# Altium project MaUWB.PrjPcb
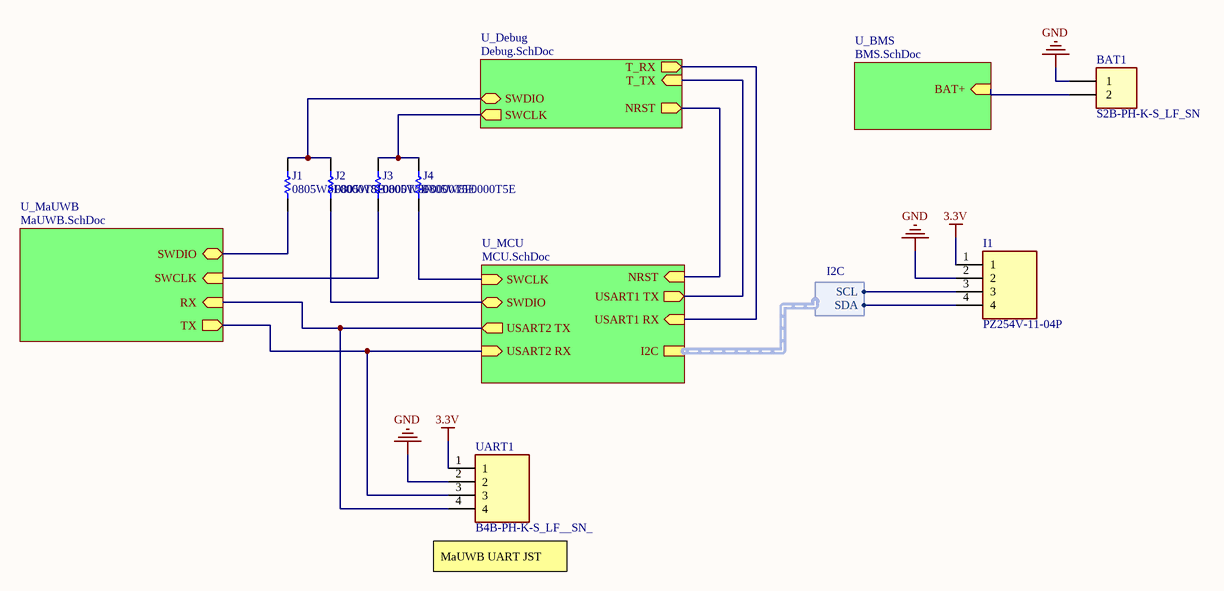
[diagram p0: Root.SchDoc]
5 sheets, 54 parts. Net scope: hierarchical (ports join the sheet entries above them; power ports are global).
Board file: PCB.PcbDoc
Sheets:
  Root.SchDoc
    U_BMS = BMS.SchDoc
    U_MaUWB = MaUWB.SchDoc
    U_MCU = MCU.SchDoc
    U_Debug = Debug.SchDoc

## Sheet Root.SchDoc
size A4; SheetNumber: 1; SheetTotal: 5

### Parts
BAT1  S2B-PH-K-S_LF_SN  [S2B-PH-K-S_LF_SN]
I1  PZ254V-11-04P  [HDRV4W64P0X254_1X4_1016X250X890P]
J1  0805W8F0000T5E  [RESC2013X65N - Duplicate1]
J2  0805W8F0000T5E  [RESC2013X65N - Duplicate1]
J3  0805W8F0000T5E  [RESC2013X65N - Duplicate1]
J4  0805W8F0000T5E  [RESC2013X65N - Duplicate1]
UART1  B4B-PH-K-S_LF__SN_  [SHDR4W50P0X200_1X4_990X450X600P]

### Sub-sheets
U_BMS = BMS.SchDoc: BAT+ (in)
U_Debug = Debug.SchDoc: SWDIO (bidir), SWCLK (out), NRST (out), T_TX (in), T_RX (out)
U_MaUWB = MaUWB.SchDoc: SWCLK (in), SWDIO (bidir), RX (in), TX (out)
U_MCU = MCU.SchDoc: NRST (in), USART2 RX (in), USART2 TX (out), SWCLK (in), SWDIO (bidir), I2C (harness I2C), USART1 RX (in), USART1 TX (out)

### Harnesses
I2C: SCL, SDA

### Nets
3.3V: I1.1 UART1.1
GND: BAT1.1 I1.2 UART1.2
BAT+: BAT1.2 ; sheet U_BMS/BAT+
I2C1_SCL: I1.3 ; sheet U_MCU/I2C.SCL
I2C1_SDA: I1.4 ; sheet U_MCU/I2C.SDA
NRST: sheet U_MCU/NRST, sheet U_Debug/NRST
SWCLK: J3.2 J4.2 ; sheet U_Debug/SWCLK
SWDIO: J1.2 J2.2 ; sheet U_Debug/SWDIO
SYS_SWCLK: J4.1 ; sheet U_MCU/SWCLK
SYS_SWDIO: J2.1 ; sheet U_MCU/SWDIO
T_RX: sheet U_MCU/USART1 RX, sheet U_Debug/T_RX
T_TX: sheet U_MCU/USART1 TX, sheet U_Debug/T_TX
USART2_RX: UART1.3 ; sheet U_MaUWB/TX, sheet U_MCU/USART2 RX
USART2_TX: UART1.4 ; sheet U_MaUWB/RX, sheet U_MCU/USART2 TX
UWB_SWCLK: J3.1 ; sheet U_MaUWB/SWCLK
UWB_SWDIO: J1.1 ; sheet U_MaUWB/SWDIO

### Notes on the sheet
- (near UART1) MaUWB UART JST

### Library data of the parts
BAT1 = S2B-PH-K-S_LF_SN: -25℃~+85℃ 1 100V 1x2P 2 2A 2P 2mm 4.8mm 5.9mm 7.6mm Brass K Pin PA66 PH Right Angle Tin UL94V-0 White 弯插,P=2mm Wire To Board Connector ROHS; Manufacturer: JST; Manu Part #: S2B-PH-K-S(LF)(SN); LCSC Part #: C173752
I1 = PZ254V-11-04P: 4 pin 2.54mm Header; Manufacturer_Name: XFCN; Manufacturer_Part_Number: PZ254V-11-04P; LCSC Part #: C2691448
J1-J4 = 0805W8F0000T5E: 0 Ohm, 0805, 1%; Manufacturer_Name: UNI-ROYAL(Uniroyal Elec); Height: 0.65mm; LCSC Part #: C17477; Manu Part #: 0805W8F0000T5E
UART1 = B4B-PH-K-S_LF__SN_: JST 4 pin; Manufacturer_Name: JST (JAPAN SOLDERLESS TERMINALS); Manu Part #: B4B-PH-K-S(LF)(SN); Datasheet Link: https://datasheet.lcsc.com/szlcsc/JST-Sales-America-B4B-PH-K-S-LF-SN_C131334.pdf; Height: 6mm; LCSC Part #: C131334

## Sheet BMS.SchDoc
size A; SheetNumber: 4; SheetTotal: 5
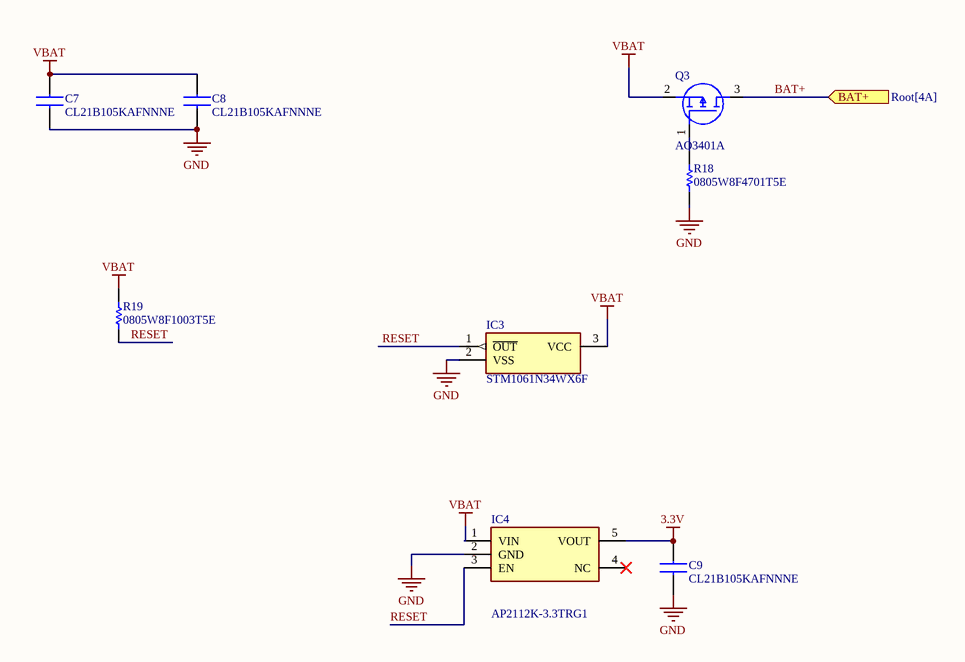
[diagram p1: BMS.SchDoc]

### Parts
C7  CL21B105KAFNNNE  [CAPC2012X135N]
C8  CL21B105KAFNNNE  [CAPC2012X135N]
C9  CL21B105KAFNNNE  [CAPC2012X135N]
IC3  STM1061N34WX6F  [SOT103P237X112-3N]
IC4  AP2112K-3.3TRG1  [SOT95P285X140-5N]
Q3  AO3401A  [SOT95P280X125-3N - duplicate]
R18  0805W8F4701T5E  [RESC2013X65N]
R19  0805W8F1003T5E  [RESC2013X65N - Duplicate2]

### Ports
BAT+ (in, see Root[4A])

### Nets
3.3V: C9.1 IC4.5(VOUT)
GND: C7.2 C8.2 C9.2 IC3.2(VSS) IC4.2(GND) R18.1
VBAT: C7.1 C8.1 IC3.3(VCC) IC4.1(VIN) Q3.2(S) R19.2
BAT+: Q3.3(D) ; port BAT+
RESET: IC3.1(~{OUT}) IC4.3(EN) R19.1
NetQ3_1: Q3.1(G) R18.2

Not connected (* = marked no-connect by the designer): IC4 4(NC)*

### Library data of the parts
C7-C9 = CL21B105KAFNNNE: 1uF, 0805, X7R; Manufacturer_Name: SAMSUNG; Manu Part #: CL21B105KBFNNNE; LCSC Part #: C28323
IC3 = STM1061N34WX6F: 3.4V Voltage Supervisor; Manufacturer_Name: STMicroelectronics; Datasheet Link: https://www.st.com/resource/en/datasheet/stm1061.pdf; Height: 1.12mm; LCSC Part #: C222402; Manu Part #: STM1061N34WX6F
IC4 = AP2112K-3.3TRG1: 3.3V 600mA LDO; Manufacturer_Name: Diodes Incorporated; Height: 1.4mm; Datasheet Link: https://www.diodes.com//assets/Datasheets/AP2112.pdf; LCSC Part #: C51118; Manu Part #: AP2112K-3.3TRG1
Q3 = AO3401A: PMOS 4.2A SOT-23; LCSC Part #: C21266; Manu Part #: AO3401A
R18 = 0805W8F4701T5E: 4.7k 0805 1%; Manufacturer_Name: UNI-ROYAL(Uniroyal Elec); LCSC Part #: C17673; Manu Part #: 0805W8F4701T5E
R19 = 0805W8F1003T5E: 100K, 0805, 1%; Manufacturer_Name: ROYALOHM; Datasheet Link: https://www.mouser.in/datasheet/2/1365/1-3044649.pdf; Height: 0.65mm; LCSC Part #: C149504; Manu Part #: 0805W8F1003T5E

## Sheet MaUWB.SchDoc
size A; SheetNumber: 3; SheetTotal: 5
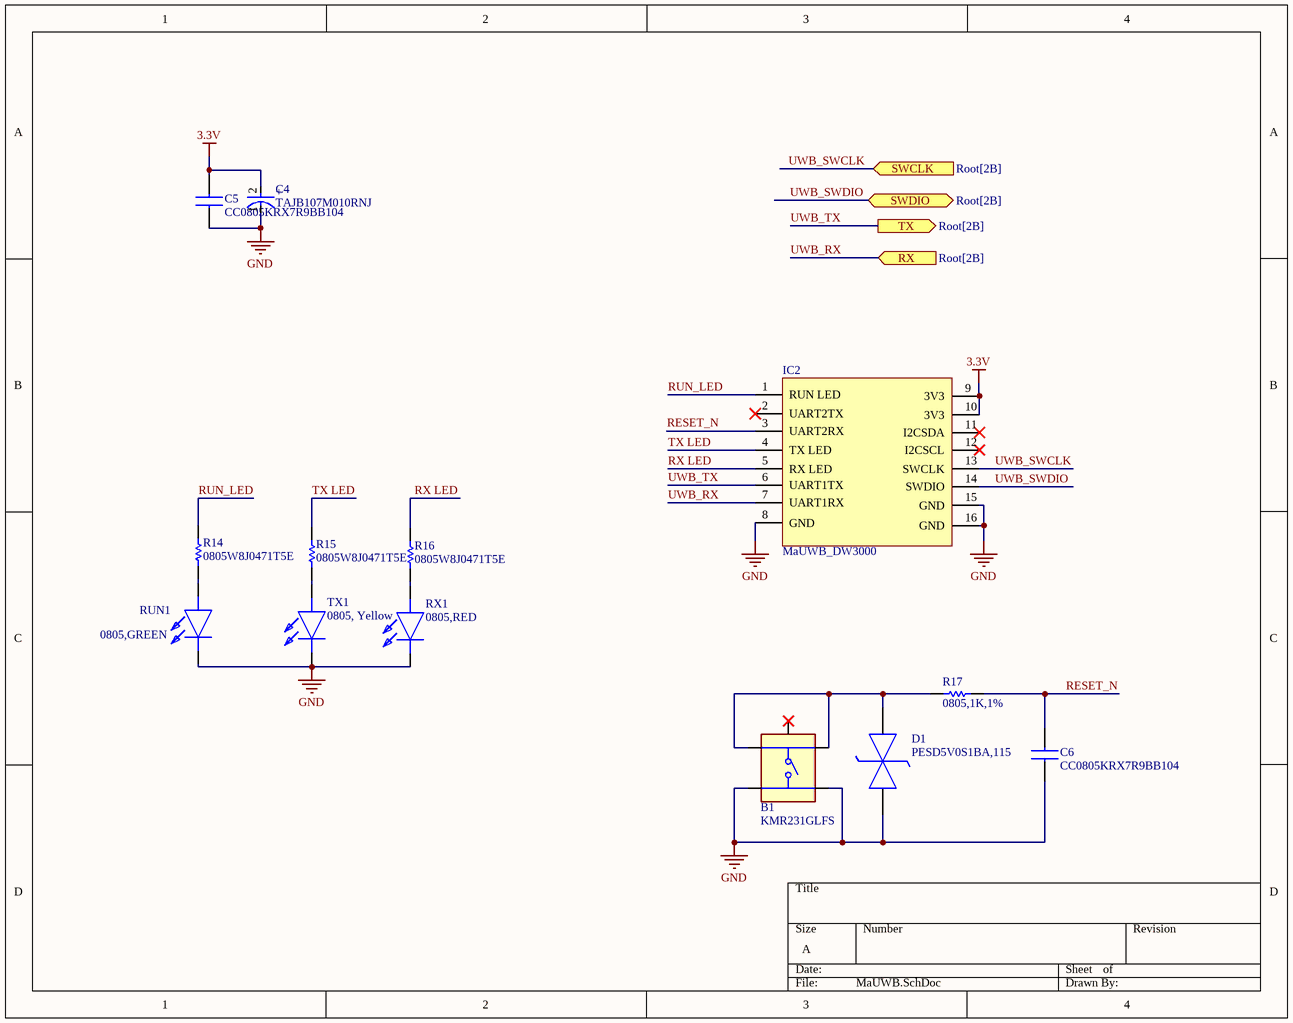
[diagram p2: MaUWB.SchDoc]

### Parts
B1  KMR231GLFS  [KMR231GLFS]
C4  TAJB107M010RNJ  [CAPPM3528X210N]
C5  CC0805KRX7R9BB104  [CAPC2012X95N]
C6  CC0805KRX7R9BB104  [CAPC2012X95N]
D1  PESD5V0S1BA,115  [SOD2512X110N]
IC2  MaUWB_DW3000  [MaUWB_DW3000]
R14  0805W8J0471T5E  [RESC2013X65N - Duplicate]
R15  0805W8J0471T5E  [RESC2013X65N - Duplicate]
R16  0805W8J0471T5E  [RESC2013X65N - Duplicate]
R17  0805,1K,1%  [RESC2013X65N - Duplicate2]
RUN1  0805,GREEN  [LEDC2012X120N]
RX1  0805,RED  [LEDC2012X120N - Duplicate]
TX1  0805, Yellow  [LEDC2012X120N - Duplicate]

### Ports
RX (in, see Root[2B]), SWCLK (in, see Root[2B]), SWDIO (bidir, see Root[2B]), TX (out, see Root[2B])

### Nets
3.3V: C4.2(A) C5.2 IC2.9(3V3) IC2.10(3V3)
GND: B1.3 B1.4 C4.1(C) C5.1 C6.1 D1.1(K1) IC2.8(GND) IC2.15(GND) IC2.16(GND) RUN1.1(K) RX1.1(K) TX1.1(K)
RESET_N: C6.2 IC2.3(UART2RX) R17.2
RUN_LED: IC2.1(RUN_LED) R14.2
RX LED: IC2.5(RX_LED) R16.2
TX LED: IC2.4(TX_LED) R15.2
UWB_RX: IC2.7(UART1RX) ; port RX  [project net USART2_TX]
UWB_SWCLK: IC2.13(SWCLK) ; port SWCLK
UWB_SWDIO: IC2.14(SWDIO) ; port SWDIO
UWB_TX: IC2.6(UART1TX) ; port TX  [project net USART2_RX]
NetB1_1: B1.1 B1.2 D1.2(K2) R17.1
NetR14_1: R14.1 RUN1.2(A)
NetR15_1: R15.1 TX1.2(A)
NetR16_1: R16.1 RX1.2(A)

Not connected (* = marked no-connect by the designer): B1 5*; IC2 2(UART2TX)* 11(I2CSDA)* 12(I2CSCL)*

### Notes on the sheet
- (in symbol TAJB107M010RNJ) +

### Library data of the parts
B1 = KMR231GLFS: Tactile Switch SPST 300gf 1.9mm Gull Wing 4.6mm x 2.8mm Surface Mount; LCSC Part #: C99271; Manu Part #: KMR231GLFS
C4 = TAJB107M010RNJ: 100uF, Tantalum; Manufacturer_Name: Kyocera AVX; LCSC part #: C7196; Manu Part #: TAJB107M010RNJ
C5 C6 = CC0805KRX7R9BB104: 100nF, 0805, X7R; Manufacturer_Name: Yageo Group; LCSC Part #: C49678; Manu Part #: CC0805KRX7R9BB104
D1 = PESD5V0S1BA,115: 14VC Clamp 12A@8/20us Ipp ESD DIODE SOD-323; Manu Part #: PESD5V0S1BA,115; LCSC Part #: C19224
R14-R16 = 0805W8J0471T5E: 470, 0805, 5%; Manufacturer_Name: ROYALOHM; Manu Part #: 0805W8F4700T5E; LCSC Part #: C17710
R17 = 0805W8F1001T5E: -55℃~+155℃ 125mW 150V 1kΩ Thick Film Resistor ±1% ±100ppm/℃ 0805 Chip Resistor - Surface Mount ROHS; Manu Part #: 0805W8F1001T5E; LCSC Part #: C17513
RUN1 = LTST-C170GKT: Green 569nm LED Indication - Discrete 2.1V 0805 (2012 Metric); Manufacturer_Name: Lite-On; Height: 1.2mm; Datasheet Link: https://mm.digikey.com/Volume0/opasdata/d220001/medias/docus/895/LTST-C170GKT.pdf; Manufacturer_Part_Number: LTST-C170GKT; Mouser Part Number: 859-LTST-C170GKT; Mouser Price/Stock: https://www.mouser.co.uk/ProductDetail/LITEON/LTST-C170GKT?qs=%2FSqKn2EfXQSV5aRij3YIfQ%3D%3D; Arrow Part Number: LTST-C170GKT; Arrow Price/Stock: https://www.arrow.com/en/products/ltst-c170gkt/lite-on-technology?utm_currency=USD&region=nac; Manu Part #: LTST-C170GKT; LCSC Part #: C125090
RX1 = LTST-C170KRKT: Red 631nm LED Indication - Discrete 2V 0805 (2012 Metric); Manufacturer_Name: Lite-On; Datasheet Link: https://componentsearchengine.com/Datasheets/1/LTST-C170KRKT.pdf; Height: 1.2mm; Manufacturer_Part_Number: LTST-C170KRKT; Mouser Part Number: 859-LTST-C170KRKT; Mouser Price/Stock: https://www.mouser.co.uk/ProductDetail/LITEON/LTST-C170KRKT?qs=NUb82WqeCyrVOID%2Fxt4rgA%3D%3D; Arrow Part Number: LTST-C170KRKT; Arrow Price/Stock: https://www.arrow.com/en/products/ltst-c170krkt/lite-on-technology?utm_currency=USD&region=nac; Manu Part #: LTST-C170KRKT; LCSC Part #: C94868
TX1 = KT-0603W: Yellow 631nm LED Indication - Discrete 2V 0805 (2012 Metric); Manufacturer_Name: Hubei KENTO Elec; Manu Part #: KT-0603W; LCSC Part #: C2290

## Sheet MCU.SchDoc
size A4; SheetNumber: 2; SheetTotal: 5
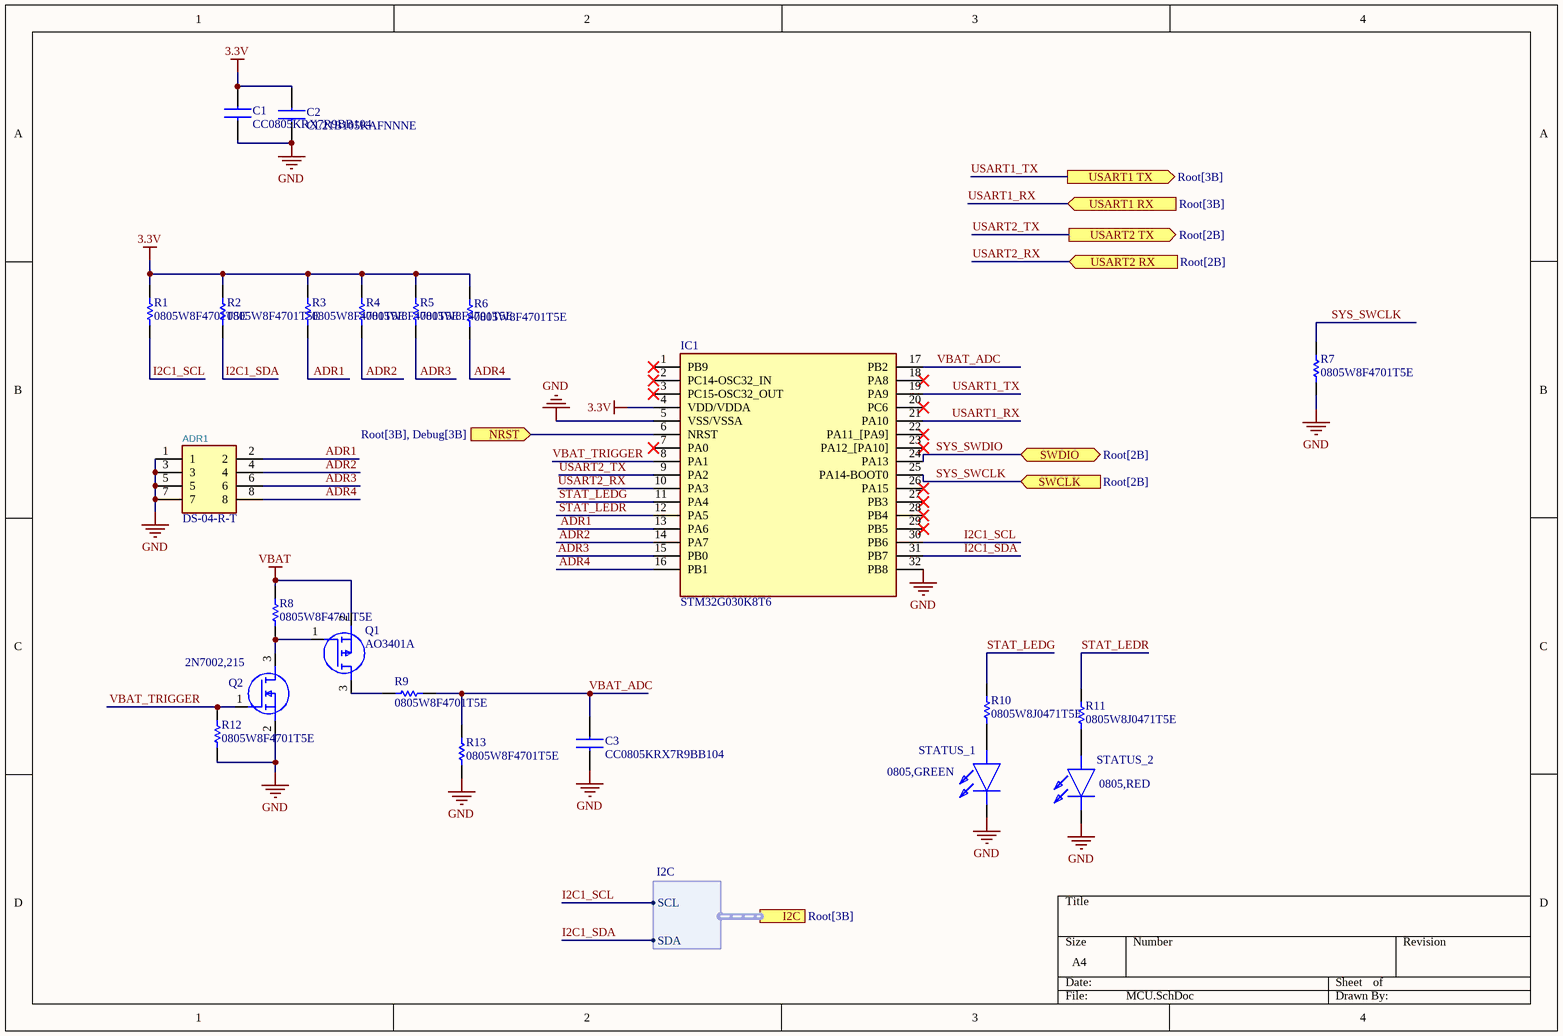
[diagram p3: MCU.SchDoc]

### Parts
ADR1  DS-04-R-T  [DS-04-R-T]
C1  CC0805KRX7R9BB104  [CAPC2012X95N]
C2  CL21B105KAFNNNE  [CAPC2012X135N]
C3  CC0805KRX7R9BB104  [CAPC2012X95N]
IC1  STM32G030K8T6  [QFP80P900X900X160-32N]
Q1  AO3401A  [SOT95P280X125-3N - duplicate]
Q2  2N7002,215  [SOT95P230X110-3N]
R1  0805W8F4701T5E  [RESC2013X65N]
R2  0805W8F4701T5E  [RESC2013X65N]
R3  0805W8F4701T5E  [RESC2013X65N]
R4  0805W8F4701T5E  [RESC2013X65N]
R5  0805W8F4701T5E  [RESC2013X65N]
R6  0805W8F4701T5E  [RESC2013X65N]
R7  0805W8F4701T5E  [RESC2013X65N]
R8  0805W8F4701T5E  [RESC2013X65N]
R9  0805W8F4701T5E  [RESC2013X65N]
R10  0805W8J0471T5E  [RESC2013X65N - Duplicate]
R11  0805W8J0471T5E  [RESC2013X65N - Duplicate]
R12  0805W8F4701T5E  [RESC2013X65N]
R13  0805W8F4701T5E  [RESC2013X65N]
STATUS_1  0805,GREEN  [LEDC2012X120N]
STATUS_2  0805,RED  [LEDC2012X120N - Duplicate]

### Ports
I2C (harness I2C, see Root[3B]), NRST (in, see Root[3B], Debug[3B]), SWCLK (in, see Root[2B]), SWDIO (bidir, see Root[2B]), USART1 RX (in, see Root[3B]), USART1 TX (out, see Root[3B]), USART2 RX (in, see Root[2B]), USART2 TX (out, see Root[2B])

### Harnesses
I2C: SCL, SDA

### Nets
3.3V: C1.2 C2.1 IC1.4(VDD/VDDA) R1.2 R2.2 R3.2 R4.2 R5.2 R6.2
GND: ADR1.1 ADR1.3 ADR1.5 ADR1.7 C1.1 C2.2 C3.1 IC1.5(VSS/VSSA) IC1.32(PB8) Q2.2(S) R7.1 R12.1 R13.1 STATUS_1.1(K) STATUS_2.1(K)
VBAT: Q1.2(S) R8.2
ADR1: ADR1.2 IC1.13(PA6) R3.1
ADR2: ADR1.4 IC1.14(PA7) R4.1
ADR3: ADR1.6 IC1.15(PB0) R5.1
ADR4: ADR1.8 IC1.16(PB1) R6.1
I2C1_SCL: IC1.30(PB6) R1.1 ; port I2C.SCL
I2C1_SDA: IC1.31(PB7) R2.1 ; port I2C.SDA
NRST: IC1.6(NRST) ; port NRST
STAT_LEDG: IC1.11(PA4) R10.2
STAT_LEDR: IC1.12(PA5) R11.2
SYS_SWCLK: IC1.25(PA14-BOOT0) R7.2 ; port SWCLK
SYS_SWDIO: IC1.24(PA13) ; port SWDIO
USART1_RX: IC1.21(PA10) ; port USART1 RX  [project net T_RX]
USART1_TX: IC1.19(PA9) ; port USART1 TX  [project net T_TX]
USART2_RX: IC1.10(PA3) ; port USART2 RX
USART2_TX: IC1.9(PA2) ; port USART2 TX
VBAT_ADC: C3.2 IC1.17(PB2) R9.1 R13.2
VBAT_TRIGGER: IC1.8(PA1) Q2.1(G) R12.2
NetQ1_1: Q1.1(G) Q2.3(D) R8.1
NetQ1_3: Q1.3(D) R9.2
NetR10_1: R10.1 STATUS_1.2(A)
NetR11_1: R11.1 STATUS_2.2(A)

Not connected (* = marked no-connect by the designer): IC1 1(PB9)* 2(PC14-OSC32_IN)* 3(PC15-OSC32_OUT)* 7(PA0)* 18(PA8)* 20(PC6)* 22(PA11_[PA9])* 23(PA12_[PA10])* 26(PA15)* 27(PB3)* 28(PB4)* 29(PB5)*

### Library data of the parts
ADR1 = DS-04-R-T: -30℃~+85℃ 2.54mm 24V 25mA 3,000 Cycles 4 Red SPST Slide, Rocked Plugin,P=2.54mm DIP Switches ROHS; Manufacturer: kangshen; Footprint: JLCImport:DS-04-R-T; LCSC Part #: C5123702; Manu Part #: DS-04-R-T
C1 C3 = CC0805KRX7R9BB104: as C5 on sheet MaUWB; LCSC Part #: C49678; Manu Part #: CC0805KRX7R9BB104
C2 = CL21B105KAFNNNE: as C7 on sheet BMS; LCSC Part #: C28323
IC1 = STM32G030K8T6: -40℃~+85℃ 12bit 2V~3.6V 30 32 Bit 64KB 64MHz 8KB ARM Cortex-M0+ Built-in+External FLASH LQFP-32(7x7) Microcontrollers (MCU/MPU/SOC) ROHS; Manufacturer_Name: STMicroelectronics; LCSC Part #: C431631; Manu Part #: STM32G030K8T6
Q1 = AO3401A: PMOS 4.2A SOT-23; LCSC Part #: C21266; Manu Part #: AO3401A
Q2 = 2N7002,215: MOSFET (N-Channel); Manufacturer_Name: Nexperia; LCSC Part #: C65189; Manu Part #: 2N7002,215
R1-R9 R12 R13 = 0805W8F4701T5E: as R18 on sheet BMS; LCSC Part #: C17673; Manu Part #: 0805W8F4701T5E
R10 R11 = 0805W8J0471T5E: as R14 on sheet MaUWB; LCSC Part #: C17710
STATUS_1 = LTST-C170GKT: as RUN1 on sheet MaUWB; Height: 1.2mm; Datasheet Link: https://mm.digikey.com/Volume0/opasdata/d220001/medias/docus/895/LTST-C170GKT.pdf; Manufacturer_Part_Number: LTST-C170GKT; Mouser Part Number: 859-LTST-C170GKT; Mouser Price/Stock: https://www.mouser.co.uk/ProductDetail/LITEON/LTST-C170GKT?qs=%2FSqKn2EfXQSV5aRij3YIfQ%3D%3D; Arrow Part Number: LTST-C170GKT; Arrow Price/Stock: https://www.arrow.com/en/products/ltst-c170gkt/lite-on-technology?utm_currency=USD&region=nac; Manu Part #: LTST-C170GKT; LCSC Part #: C125090
STATUS_2 = LTST-C170KRKT: as RX1 on sheet MaUWB; Datasheet Link: https://componentsearchengine.com/Datasheets/1/LTST-C170KRKT.pdf; Height: 1.2mm; Manufacturer_Part_Number: LTST-C170KRKT; Mouser Part Number: 859-LTST-C170KRKT; Mouser Price/Stock: https://www.mouser.co.uk/ProductDetail/LITEON/LTST-C170KRKT?qs=NUb82WqeCyrVOID%2Fxt4rgA%3D%3D; Arrow Part Number: LTST-C170KRKT; Arrow Price/Stock: https://www.arrow.com/en/products/ltst-c170krkt/lite-on-technology?utm_currency=USD&region=nac; Manu Part #: LTST-C170KRKT; LCSC Part #: C94868

## Sheet Debug.SchDoc
size A; SheetNumber: 5; SheetTotal: 5
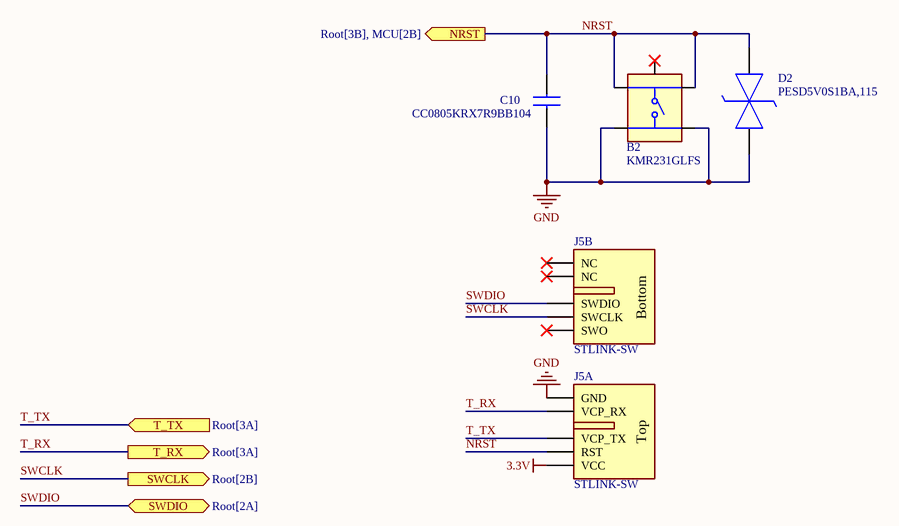
[diagram p4: Debug.SchDoc]

### Parts
B2  KMR231GLFS  [KMR231GLFS]
C10  CC0805KRX7R9BB104  [CAPC2012X95N]
D2  PESD5V0S1BA,115  [SOD2512X110N]
J5  STLINK-SW  [009159010061911]  (parts A,B of 2)  (no BOM)

### Ports
NRST (out, see Root[3B], MCU[2B]), SWCLK (out, see Root[2B]), SWDIO (bidir, see Root[2A]), T_RX (out, see Root[3A]), T_TX (in, see Root[3A])

### Nets
3.3V: J5.5(VCC)
GND: B2.3 B2.4 C10.1 D2.1(K1) J5.1(GND)
NRST: B2.1 B2.2 C10.2 D2.2(K2) J5.4(RST) ; port NRST
SWCLK: J5.9(SWCLK) ; port SWCLK
SWDIO: J5.8(SWDIO) ; port SWDIO
T_RX: J5.2(VCP_RX) ; port T_RX
T_TX: J5.3(VCP_TX) ; port T_TX

Not connected (* = marked no-connect by the designer): B2 5*; J5 6(NC)* 7(NC)* 10(SWO)*

### Notes on the sheet
- (in symbol STLINK-SW, part A) Top
- (in symbol STLINK-SW, part B) Bottom

### Library data of the parts
B2 = KMR231GLFS: as B1 on sheet MaUWB; LCSC Part #: C99271; Manu Part #: KMR231GLFS
C10 = CC0805KRX7R9BB104: as C5 on sheet MaUWB; LCSC Part #: C49678; Manu Part #: CC0805KRX7R9BB104
D2 = PESD5V0S1BA,115: as D1 on sheet MaUWB; Manu Part #: PESD5V0S1BA,115; LCSC Part #: C19224
J5 = STLINK-SW: SSL Connector 10 Position Adapter, Bridge Board to Board - Card Edge 0.079" (2.00mm)

## Nets that join several sheets
3.3V: Root (I1.1 UART1.1), BMS (C9.1 IC4.5), MaUWB (C4.2 C5.2 IC2.9 IC2.10), MCU (9 pins), Debug (J5.5)
GND: Root (BAT1.1 I1.2 UART1.2), BMS (6 pins), MaUWB (12 pins), MCU (15 pins), Debug (5 pins)
VBAT: BMS (6 pins), MCU (Q1.2 R8.2)
BAT+: Root (BAT1.2), BMS (Q3.3)
I2C1_SCL: Root (I1.3), MCU (IC1.30 R1.1)
I2C1_SDA: Root (I1.4), MCU (IC1.31 R2.1)
NRST: MCU (IC1.6), Debug (5 pins)
SWCLK: Root (J3.2 J4.2), Debug (J5.9)
SWDIO: Root (J1.2 J2.2), Debug (J5.8)
SYS_SWCLK: Root (J4.1), MCU (IC1.25 R7.2)
SYS_SWDIO: Root (J2.1), MCU (IC1.24)
T_RX: MCU (IC1.21), Debug (J5.2)
T_TX: MCU (IC1.19), Debug (J5.3)
USART2_RX: Root (UART1.3), MaUWB (IC2.6), MCU (IC1.10)
USART2_TX: Root (UART1.4), MaUWB (IC2.7), MCU (IC1.9)
UWB_SWCLK: Root (J3.1), MaUWB (IC2.13)
UWB_SWDIO: Root (J1.1), MaUWB (IC2.14)

## Assembly variants
Variant of MaUWB: not fitted I2C IC4 J1 J7